# Altium schematic sheet 8.15A0.0642001_8.15A0.064200.schdoc.schdoc
size 127 x 180 mm
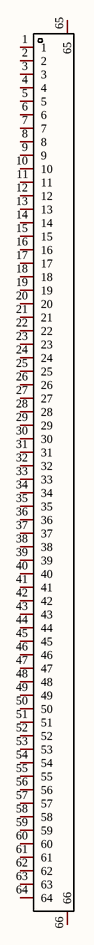
[diagram p0: 8.15A0.0642001_8.15A0.064200.schdoc.schdoc]

## Parts
FPC?  8.15A0.064200  [FPC-SMD_64P-P0.50_8.15A0.064200]  (value not drawn)

## Nets

Not connected (* = marked no-connect by the designer): FPC? 1 2 3 4 5 6 7 8 9 10 11 12 13 14 15 16 17 18 19 20 21 22 23 24 25 26 27 28 29 30 31 32 33 34 35 36 37 38 39 40 41 42 43 44 45 46 47 48 49 50 51 52 53 54 55 56 57 58 59 60 61 62 63 64 65 66

## Library data of the parts
FPC? = 8.15A0.064200: Manufacturer: DIANWEI(钿威科技); Add into BOM: yes; Locking Feature: Clamshell; Number of Contacts: 64P; Pitch: 0.5mm; Symbol: 8.15A0.064200; Device: 8.15A0.064200; LCSC Part Name: 翻盖式 下接 P数:64P 间距:0.5mm; Supplier Part: C20626047; Manufacturer Part: 8.15A0.064200; Supplier Footprint: SMD,P=0.5mm,卧贴; JLCPCB Part Class: Extended Part; Datasheet: https://atta.szlcsc.com/upload/public/pdf/source/20240226/9B0E964ABAD9EBDCC7FF6472C3CD9B36.pdf; Supplier: LCSC; Convert to PCB: yes; Contact Type: Bottom Contact; Height Above Board: 1.8mm; Contact Plating: Gold